# EasyEDA Pro project 心电检测采集模块.eprj

# Schematic Schematic1
Create Date: 2024-03-05; Page Name: P1; Project Name: 心电检测采集模块; Schematic Name: Schematic1; Update Date: 2024-03-05; Company: 嘉立创EDA; Page Size: A4; Version: V1.0
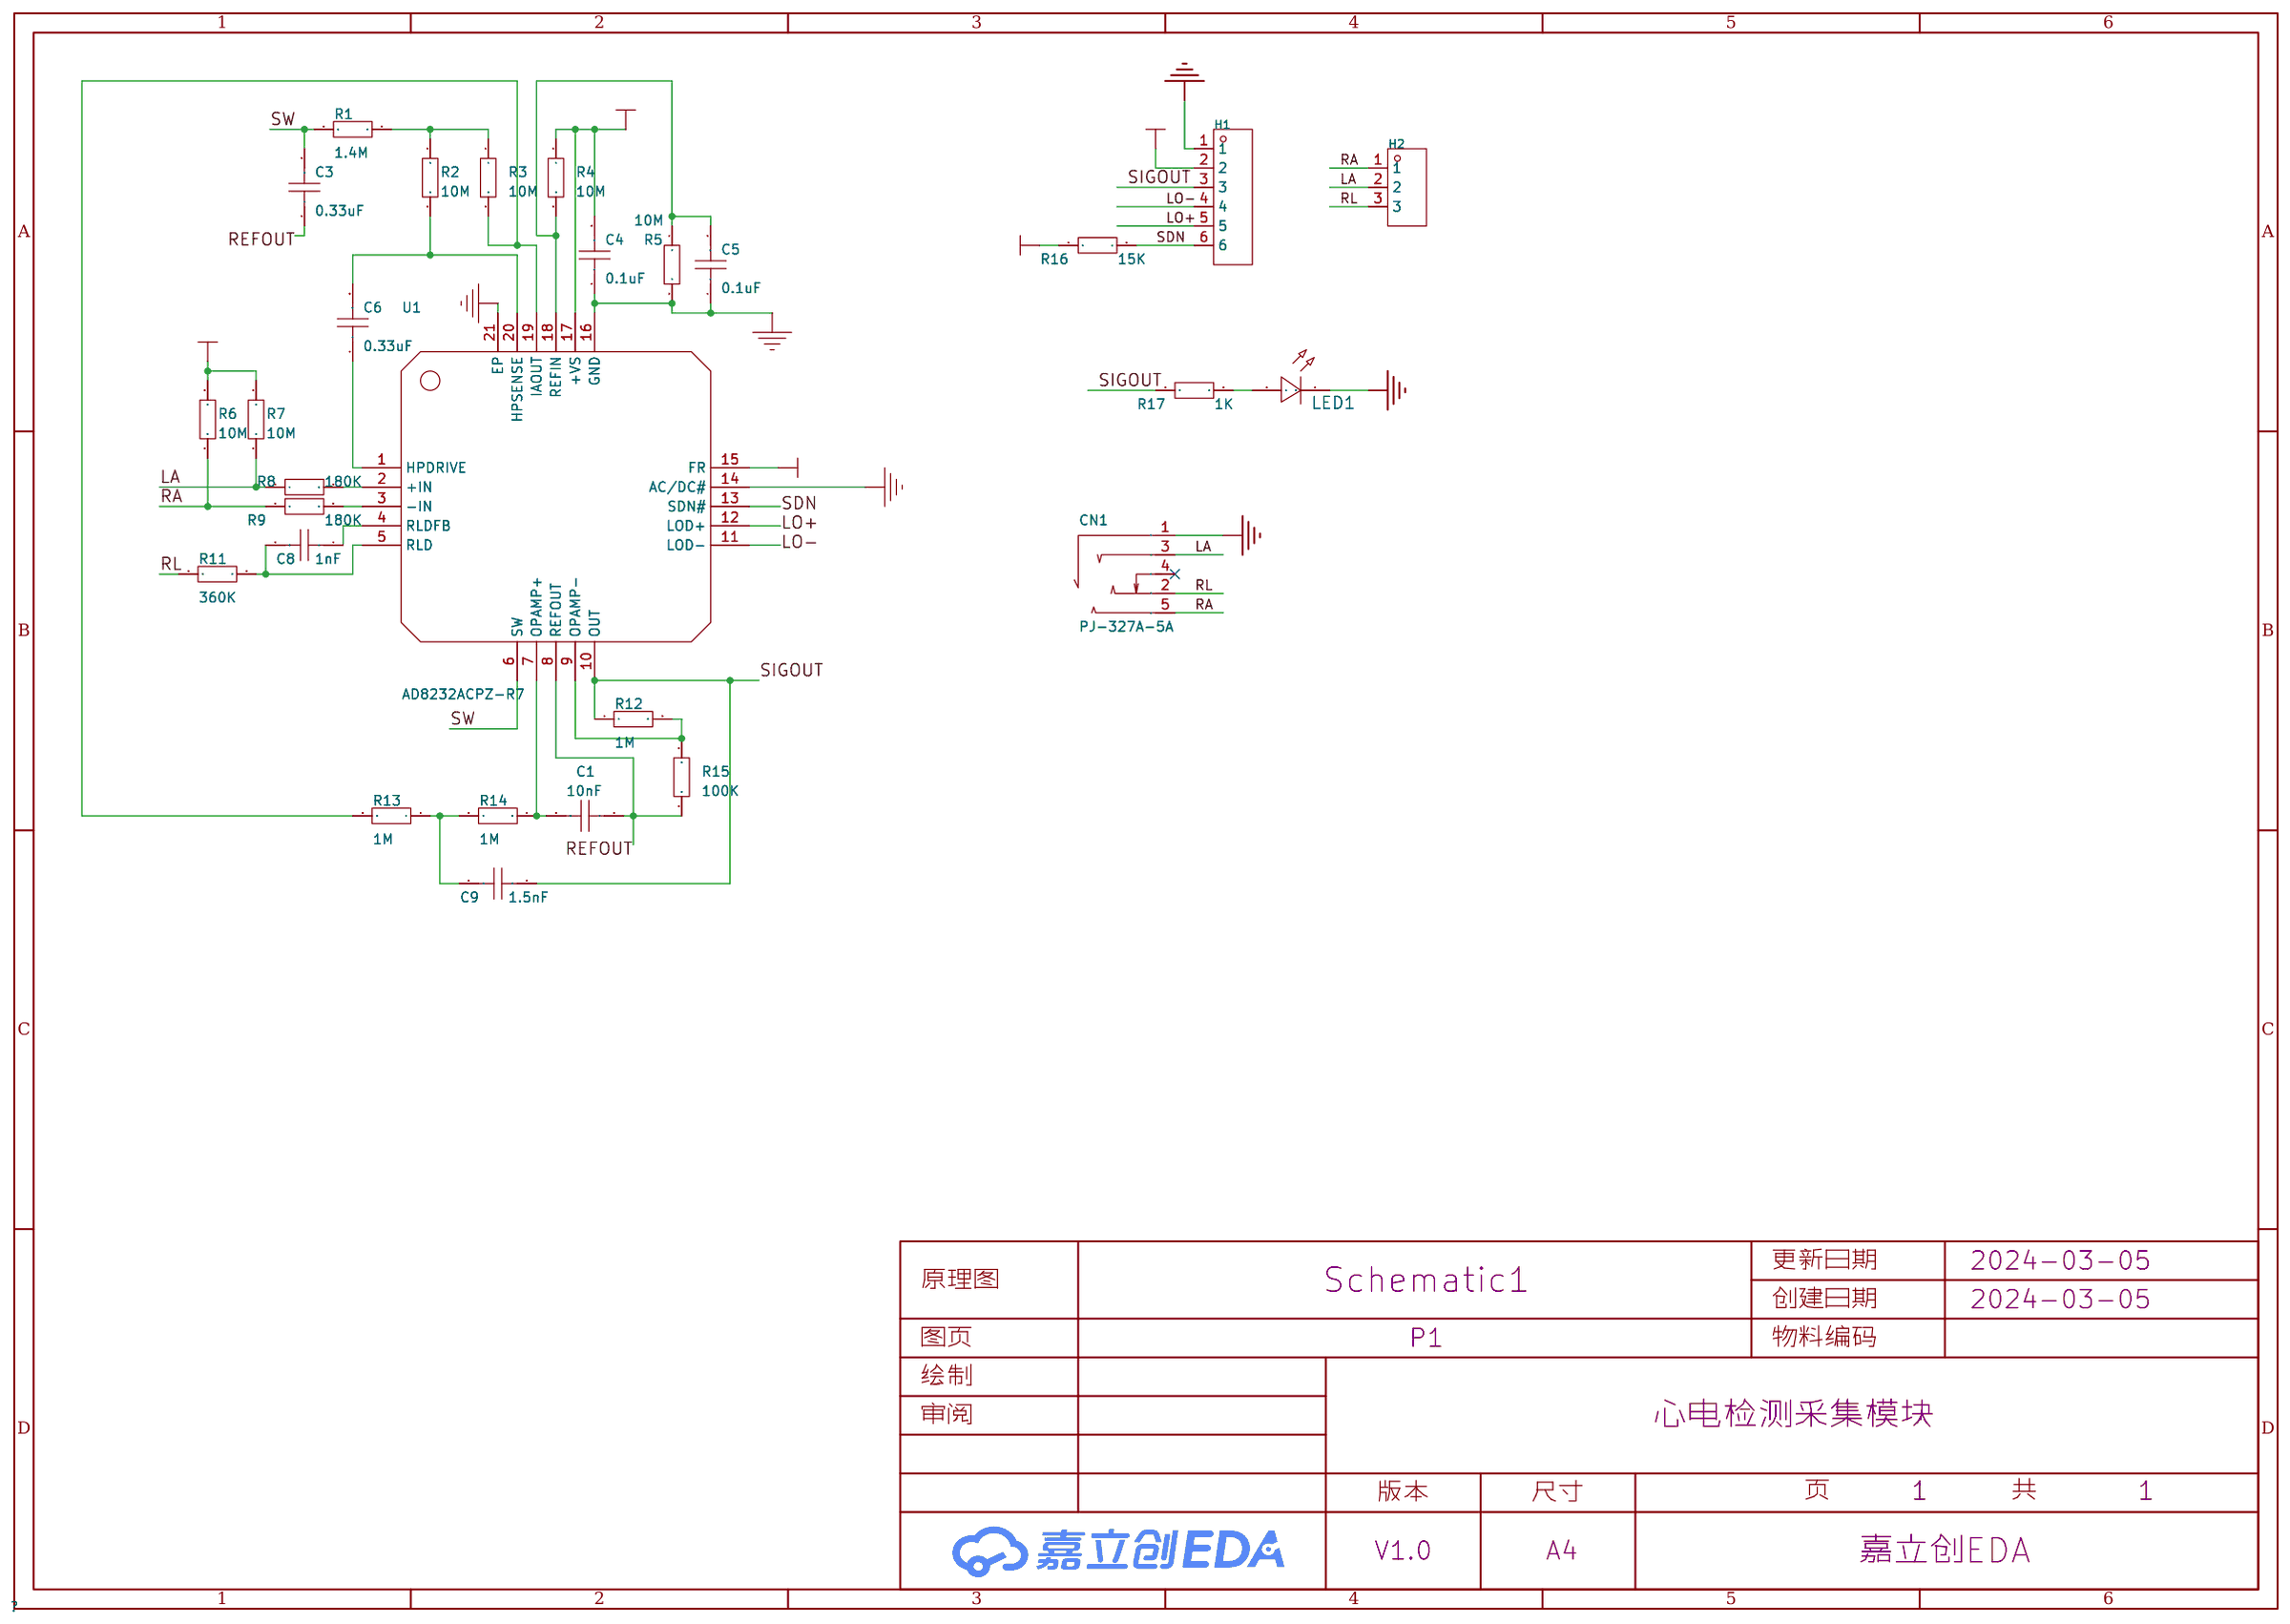
[diagram p0: schematic sheet]

## Parts
C1  10nF  [C0402]
C3  0.33uF  [C0402]
C4  0.1uF  [C0402]
C5  0.1uF  [C0402]
C6  0.33uF  [C0402]
C8  1nF  [C0402]
C9  1.5nF  [C0402]
CN1  PJ-327A-5A  [AUDIO-SMD_PJ-327A-5A]
H1  -  [HDR-TH_6P-P2.54-V-F]
H2  -  [HDR-TH_3P-P2.54-V-F]
LED1  -  [LED_0603]
R1  1.4M  [R0402]
R2  10M  [R0402]
R3  10M  [R0402]
R4  10M  [R0402]
R5  10M  [R0402]
R6  10M  [R0402]
R7  10M  [R0402]
R8  180K  [R0402]
R9  180K  [R0402]
R11  360K  [R0402]
R12  1M  [R0402]
R13  1M  [R0402]
R14  1M  [R0402]
R15  100K  [R0402]
R16  15K  [R0402]
R17  1K  [R0402]
U1  AD8232ACPZ-R7  [LFCSP-20_L4.0-W4.0-P0.50-TL-EP2.7]

## Library data of the parts
C1 C3-C6 C8 C9 = CAP_0402: Supplier Footprint: 0402
CN1 = PJ-327A-5A: 连接器类型:3.5mm耳机座;额定电流:500mA;额定电压:30V;工作温度范围:-40℃~+80℃;; LCSC Part Name: 3.5mm耳机座; Supplier Part: C840364; Manufacturer: 韩国韩荣; Supplier Footprint: SMD; JLCPCB Part Class: Extended Part; Datasheet: https://atta.szlcsc.com/upload/public/pdf/source/20200918/C840364_74290012F76780C6C7E2B668A307BBBC.pdf; Supplier: LCSC; Connector Type: 3.5mm耳机座; Current Rating (Max): 500mA; Voltage Rating (Max): 30V; Operating Temperature Range: -40℃~+80℃
H1 = HDR-F_2.54_1x6P: Supplier Part: C40877; Supplier Footprint: 插件
H2 = HDR-F_2.54_1x3P: Supplier Part: C541850; Supplier Footprint: 插件
LED1 = LED_0603-R: Supplier Footprint: 0603
R1-R9 R11-R17 = Res_0402: Supplier Footprint: 0402
U1 = AD8232ACPZ-R7: Supplier Part: C43216; Manufacturer: ADI(亚德诺); Supplier Footprint: LFCSP-20(4x4); JLCPCB Part Class: Extended Part; Datasheet: https://atta.szlcsc.com/upload/public/pdf/source/20150319/1457707267132.pdf; Supplier: LCSC

## Nets
GND: C4.1 C5.1 CN1.1 H1.1 LED1.1(C) R5.2 U1.14(AC/DC#) U1.16(GND) U1.21(EP)
LA: CN1.3 H2.2 R7.1 R8.1
LO+: H1.5 U1.12(LOD+)
LO-: H1.4 U1.11(LOD-)
RA: CN1.5 H2.1 R6.1 R9.1
REFOUT: C1.1 C3.1 R15.2 U1.8(REFOUT)
RL: CN1.2 H2.3 R11.1
SDN: H1.6 R16.2 U1.13(SDN#)
SIGOUT: C9.1 H1.3 R12.1 R17.1 U1.10(OUT)
SW: C3.2 R1.2 U1.6(SW)
VS: C4.2 H1.2 R4.1 R6.2 R7.2 R16.1 U1.15(FR) U1.17(+VS)
$1N1619: C5.2 R4.2 R5.1 U1.18(REFIN)
$1N1644: R3.2 R13.2 U1.19(IAOUT)
$1N1653: R1.1 R2.1 R3.1
$1N1658: C6.2 R2.2 U1.20(HPSENSE)
$1N1680: C6.1 U1.1(HPDRIVE)
$1N1683: C9.2 R13.1 R14.2
$1N1688: C1.2 R14.1 U1.7(OPAMP+)
$1N1699: R12.2 R15.1 U1.9(OPAMP-)
$1N1716: R8.2 U1.2(+IN)
$1N1718: R9.2 U1.3(-IN)
$1N1730: C8.2 R11.2 U1.5(RLD)
$1N1739: C8.1 U1.4(RLDFB)
$1N2209: LED1.2(A) R17.2

Not connected (* = marked no-connect by the designer): CN1 4*

# Schematic AD8232_0402ascii
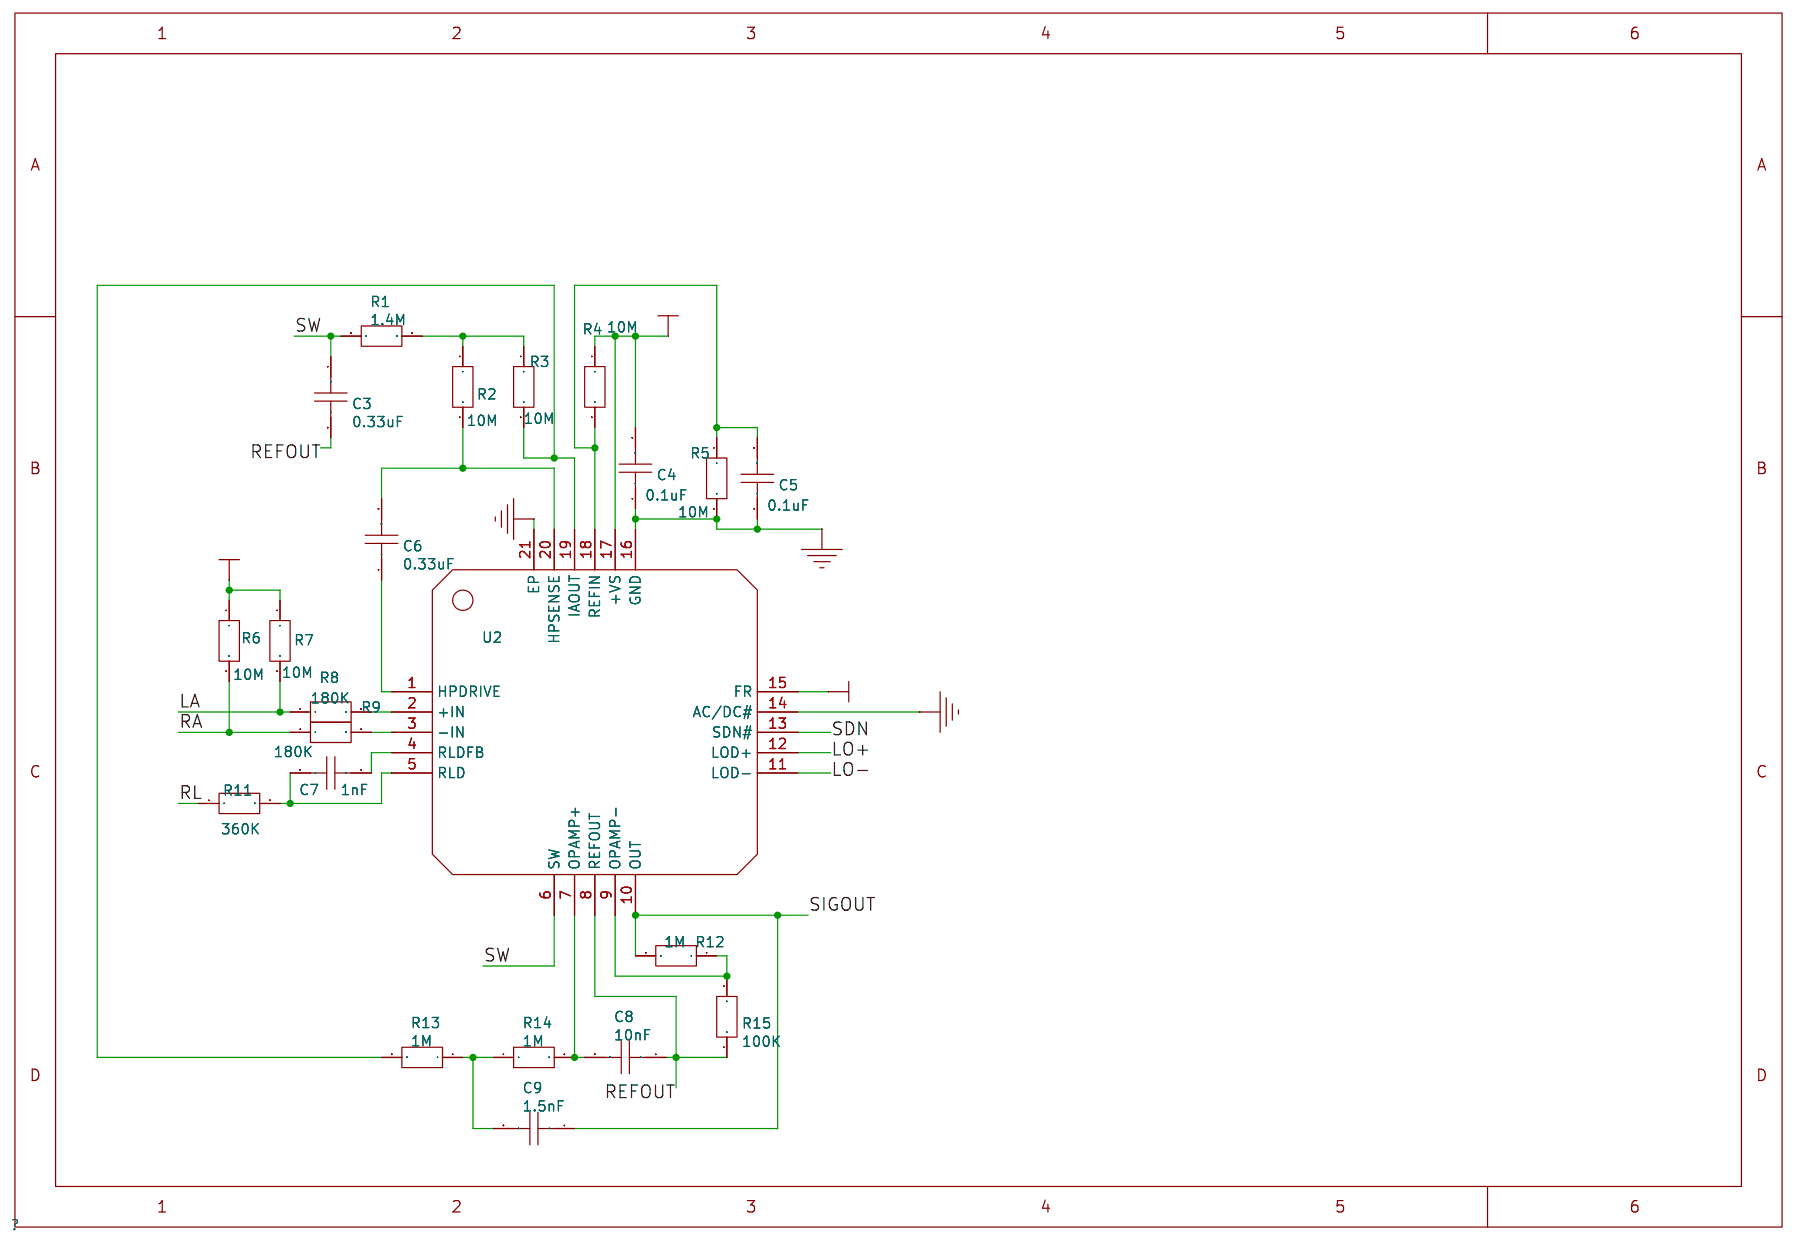
[diagram p1: schematic sheet]

## Parts
C3  0.33uF
C4  0.1uF
C5  0.1uF
C6  0.33uF
C7  1nF
C8  10nF
C9  1.5nF
R1  1.4M
R2  10M
R3  10M
R4  10M
R5  10M
R6  10M
R7  10M
R8  180K
R9  180K
R11  360K
R12  1M
R13  1M
R14  1M
R15  100K
U2  AD8232ACPZ-R7

## Library data of the parts
C3 C6 = 0.33uF: Supplier: LCSC; Supplier Part: C525264; Manufacturer: PSA(Prosperity Dielectrics); Manufacturer Part: FN18X103K500PSG
C4 C5 = 0.1uF: Supplier: LCSC; Supplier Part: C525264; Manufacturer: PSA(Prosperity Dielectrics); Manufacturer Part: FN18X103K500PSG
C7 = 1nF: Supplier: LCSC; Supplier Part: C525264; Manufacturer: PSA(Prosperity Dielectrics); Manufacturer Part: FN18X103K500PSG
C8 = 10nF: Supplier: LCSC; Supplier Part: C525264; Manufacturer: PSA(Prosperity Dielectrics); Manufacturer Part: FN18X103K500PSG
C9 = 1.5nF: Supplier: LCSC; Supplier Part: C525264; Manufacturer: PSA(Prosperity Dielectrics); Manufacturer Part: FN18X103K500PSG
R1 = 1.4M: Supplier: LCSC; Supplier Part: C965177; Manufacturer: UNI-ROYAL(Uniroyal Elec); Manufacturer Part: NQ03WAF1602T5E
R2-R7 = 10M: Supplier: LCSC; Supplier Part: C965177; Manufacturer: UNI-ROYAL(Uniroyal Elec); Manufacturer Part: NQ03WAF1602T5E
R8 R9 = 180K: Supplier: LCSC; Supplier Part: C965177; Manufacturer: UNI-ROYAL(Uniroyal Elec); Manufacturer Part: NQ03WAF1602T5E
R11 = 360K: Supplier: LCSC; Supplier Part: C965177; Manufacturer: UNI-ROYAL(Uniroyal Elec); Manufacturer Part: NQ03WAF1602T5E
R12-R14 = 1M: Supplier: LCSC; Supplier Part: C965177; Manufacturer: UNI-ROYAL(Uniroyal Elec); Manufacturer Part: NQ03WAF1602T5E
R15 = 100K: Supplier: LCSC; Supplier Part: C965177; Manufacturer: UNI-ROYAL(Uniroyal Elec); Manufacturer Part: NQ03WAF1602T5E
U2 = AD8232ACPZ-R7: Supplier: LCSC; Manufacturer: ADI; image: //image.lceda.cn/szlcsc/C43216.jpg; Supplier Part: C43216; Paste Type: expand

## Nets
GND: C4.1 C5.1 R5.2 U2.14(AC/DC#) U2.16(GND) U2.21(EP)
LA: R7.2 R8.1
LO+: U2.12(LOD+)
LO-: U2.11(LOD-)
RA: R6.2 R9.1
REFOUT: C3.2 C8.1 R15.1 U2.8(REFOUT)
RL: R11.1
SDN: U2.13(SDN#)
SIGOUT: C9.1 R12.2 U2.10(OUT)
SW: C3.1 R1.1 U2.6(SW)
VS: C4.2 R4.1 R6.1 R7.1 U2.15(FR) U2.17(+VS)
Net-(C5-2): C5.2 R4.2 R5.1 U2.18(REFIN)
Net-(C6-1): C6.1 U2.1(HPDRIVE)
Net-(C6-2): C6.2 R2.2 U2.20(HPSENSE)
Net-(C7-1): C7.1 U2.4(RLDFB)
Net-(C7-2): C7.2 R11.2 U2.5(RLD)
Net-(C8-2): C8.2 R14.2 U2.7(OPAMP+)
Net-(C9-2): C9.2 R13.1 R14.1
Net-(R1-2): R1.2 R2.1 R3.1
Net-(R3-2): R3.2 R13.2 U2.19(IAOUT)
Net-(R8-2): R8.2 U2.2(+IN)
Net-(R9-2): R9.2 U2.3(-IN)
Net-(R12-1): R12.1 R15.2 U2.9(OPAMP-)

# Board PCB1
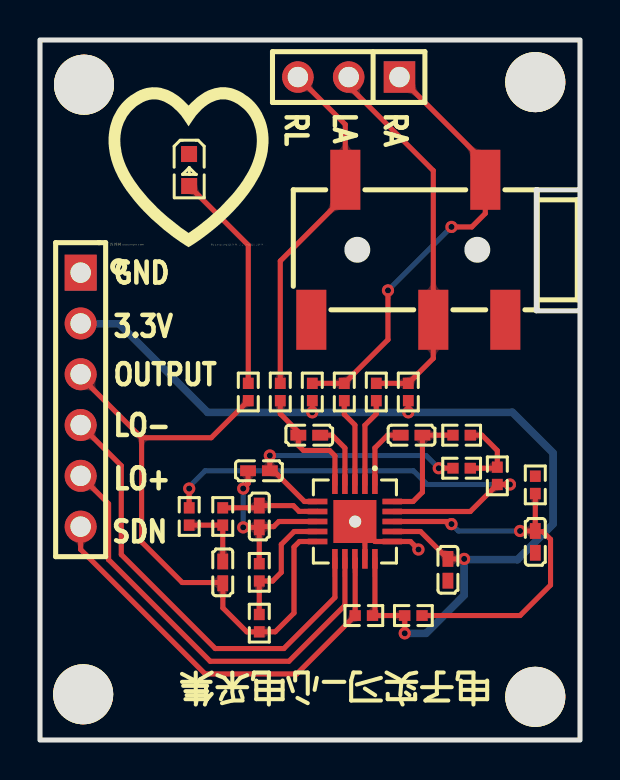
[diagram p2: board, top side]
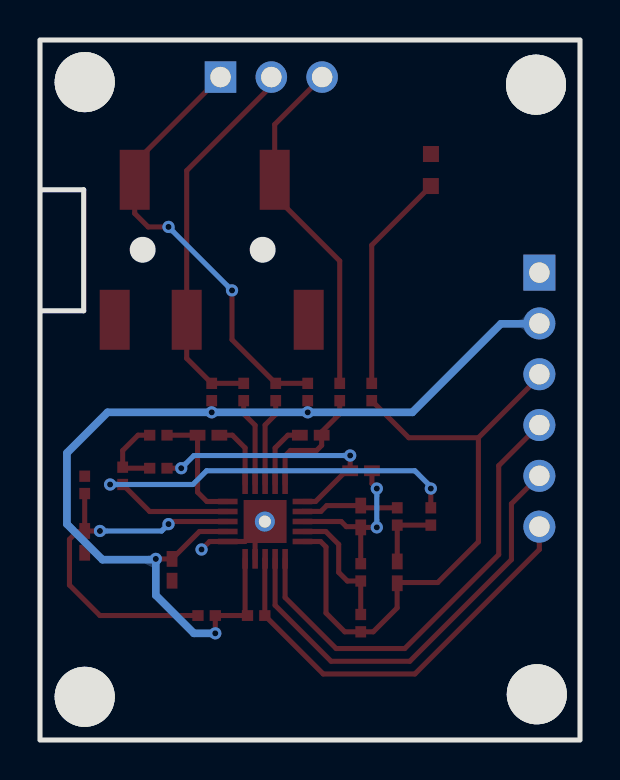
[diagram p3: board, bottom side, seen from below]

Outline 27 x 35 mm; copper layers: Top Layer, Bottom Layer. Coordinates in mm from the lower left corner of the outline.
Outline path: rectangle 0,35 27,0
Stack: Top Layer 0.035mm / Dielectric1 1.51mm FR4 er 4.5 / Bottom Layer 0.035mm

## Design rules (mm)
template: JLCPCB Capability(Two Layers Board)
spacing copperThickness1oz (default): track to track 0.102, other pairs 0.152 to 0.3
spacing copperThickness2oz: track to track 0.203, other pairs 0.152 to 0.3
track width copperThickness1oz (default): min 0.127, default 0.254, max 2.54
track width copperThickness2oz: min 0.203, default 0.254, max 2.54
differential pair differentialPair (default): width min 0.127, default 0.254, max 2.54; gap min 0.152, default 0.152
via viaSize (default): diameter min 0.5, default 0.61, max 10; hole min 0.3, default 0.305, max 6.3

## Placement (name value [footprint] x y rotation side)
C1  10nF  [C0402]  10.96 11.18 90 top
C3  0.33uF  [C0402]  10.95 13.46 0 top
C4  0.1uF  [C0402]  20.4 8.51 90 top
C5  0.1uF  [C0402]  24.76 9.91 90 top
C6  0.33uF  [C0402]  18.58 15.24 0 top
C8  1nF  [C0402]  13.46 15.24 180 top
C9  1.5nF  [C0402]  9.14 8.38 90 top
CN1  PJ-327A-5A  [AUDIO-SMD_PJ-327A-5A]  18.41 24.51 180 top
H1  -  [HDR-TH_6P-P2.54-V-F]  2.03 17.02 270 top
H2  -  [HDR-TH_3P-P2.54-V-F]  15.43 33.15 180 top
LED1  -  [LED_0603]  7.46 28.45 270 top
NOREF  -  [Pad_e689]  24.76 32.89 0 top
NOREF#2  -  [Pad_e691]  2.16 2.29 0 top
NOREF#3  -  [Pad_e443]  15.76 10.92 0 top
NOREF#4  -  [Pad_e690]  24.76 2.16 0 top
NOREF#5  -  [Pad_e687]  2.2 32.77 0 top
R1  1.4M  [R0402]  21.08 13.59 180 top
R2  10M  [R0402]  21.08 15.24 180 top
R3  10M  [R0402]  22.87 13.21 270 top
R4  10M  [R0402]  18.67 6.22 0 top
R5  10M  [R0402]  24.76 12.76 90 top
R6  10M  [R0402]  13.61 17.4 270 top
R7  10M  [R0402]  18.41 17.4 270 top
R8  180K  [R0402]  16.81 17.4 270 top
R9  180K  [R0402]  15.21 17.4 270 top
R11  360K  [R0402]  12.01 17.4 270 top
R12  1M  [R0402]  10.96 5.84 90 top
R13  1M  [R0402]  7.46 11.18 90 top
R14  1M  [R0402]  9.14 11.18 270 top
R15  100K  [R0402]  10.96 8.38 90 top
R16  15K  [R0402]  16.19 6.22 180 top
R17  1K  [R0402]  10.41 17.4 90 top
U1  AD8232ACPZ-R7  [LFCSP-20_L4.0-W4.0-P0.50-TL-EP2.7]  15.75 10.92 270 top

## Footprints (pads in the part's own frame, mm; a bottom-side part is the same pattern mirrored in y, then rotated)
AUDIO-SMD_PJ-327A-5A
  rect 1.5x3 smd: 1(-4.85,3.5) 2(3.15,-3.5) 3(-1.25,3.5) 4(4.85,3.5) 5(-3.85,-3.5)
C0402
  rect 0.79x0.54 smd: 1(-0.545,0) 2(0.545,0)
HDR-TH_3P-P2.54-V-F
  rect 1.575x1.575 hole 1.02: 1(-2.54,0)
  round 1.575 hole 1.02: 2(0,0) 3(2.54,0)
HDR-TH_6P-P2.54-V-F
  rect 1.8x1.6 hole 1.02: 1(-6.35,0)
  round 1.6 hole 1.02: 2(-3.81,0) 3(-1.27,0) 4(1.27,0) 5(3.81,0) 6(6.35,0)
LED_0603
  rect 0.8x0.8 smd: 1(-0.851,-0.01) 2(0.75,-0.005)
LFCSP-20_L4.0-W4.0-P0.50-TL-EP2.7
  rect 0.985x0.28 smd: 1(-1.867,1) 2(-1.867,0.5) 3(-1.867,0) 4(-1.867,-0.5) 5(-1.867,-1) 11(1.867,-1) 12(1.867,-0.5) 13(1.867,0) 14(1.867,0.5) 15(1.867,1)
  rect 0.28x0.985 smd: 6(-1,-1.867) 7(-0.5,-1.867) 8(0,-1.867) 9(0.5,-1.867) 10(1,-1.867) 16(1,1.867) 17(0.5,1.867) 18(0,1.867) 19(-0.5,1.867) 20(-1,1.867)
  rect 2.15x2.15 smd: 21(0,0)
Pad_e443
  round 1 hole 0.6: 22(0,0)
Pad_e687
  round 3 hole 3: 23(0,0)
Pad_e689
  round 3 hole 3: 23(0,0)
Pad_e690
  round 3 hole 3: 23(0,0)
Pad_e691
  round 3 hole 3: 23(0,0)
R0402
  rect 0.566x0.54 smd: 1(-0.433,0) 2(0.433,0)

## Nets
As in the schematic, except:
GND: C4.1 C5.1 CN1.1 H1.1 LED1.1 NOREF.23 NOREF#2.23 NOREF#3.22 NOREF#4.23 NOREF#5.23 R5.2 U1.14 U1.16 U1.21

Pads without a net: CN1 4

## Via types
v1: diameter 0.61, hole 0.305, Top Layer to Bottom Layer, 15 vias

## Routing (per net, layer and track width the routed paths; a pad name or vN(x,y) marks a point on that pad's centre or on a via; arc(x,y) is an arc through that point)
GND: length 5.1
  Top Layer w0.254: 16.25,10.42 U1.21 ; 16.25,10.42 U1.14 ; 16.25,10.42 16.75,9.92 U1.16 18.52,9.92 v1(18.92,9.53)
LA: length 19.2
  Top Layer w0.254: H2.2 15.43,32.7 19.66,28.47 CN1.3 19.66,19.08 R7.1 R8.1
LO+: length 22.2
  Top Layer w0.254: U1.12 15.25,6.74 12.45,3.94 8.51,3.94 3.43,9.02 3.43,11.81 H1.5
LO-: length 22.9
  Top Layer w0.254: H1.4 4.06,13.72 4.06,9.27 8.76,4.57 12.19,4.57 14.75,7.13 U1.11
RA: length 22.2
  Top Layer w0.254: H2.1 22.26,28.86 CN1.5 22.26,26.33 21.59,25.65 v1(20.57,25.65) ; R6.1 R9.1 17.4,20.02 v1(17.4,22.48)
  Bottom Layer w0.254: v1(20.57,25.65) v1(17.4,22.48)
REFOUT: length 8.6
  Top Layer w0.254: R15.2 C1.1 ; C1.1 11,10.67 11.68,10.67 11.94,10.92 U1.8 ; C1.1 v1(10.16,10.63) ; v1(10.16,12.57) 10.4,12.81 C3.1
  Bottom Layer w0.254: v1(10.16,10.63) v1(10.16,12.57)
RL: length 17.6
  Top Layer w0.254: R11.1 12.01,23.95 15.26,27.2 CN1.2 15.26,30.78 H2.3
SDN: length 21.5
  Top Layer w0.254: U1.13 15.76,9.04 R16.2 12.84,3.3 8.25,3.3 2.03,9.53 H1.6
SIGOUT: length 30.9
  Top Layer w0.254: R17.1 8.56,15.11 5.08,15.11 ; U1.10 12.97,9.92 12.7,9.65 12.7,6.35 11.76,5.41 R12.1 10.34,5.41 9.14,6.6 9.14,7.83 C9.1 9.1,7.87 7.11,7.87 5.08,9.91 5.08,15.11 ; H1.3 2.03,18.16 5.08,15.11
SW: length 13.2
  Top Layer w0.254: R1.2 v1(19.94,13.59) ; v1(11.49,14.22) C3.2 11.68,13.46 13.22,11.92 U1.6
  Bottom Layer w0.254: v1(11.49,14.22) 19.3,14.22 v1(19.94,13.59)
VS: length 51.3
  Top Layer w0.254: R7.2 v1(18.41,16.38) ; v1(18.24,5.33) R4.1 16.87,6.22 16.75,6.34 ; v1(21.21,9.05) C4.2 19.03,10.42 U1.17 ; R6.2 v1(13.61,16.38) ; 16.75,6.34 U1.15 ; 16.75,6.34 R16.1
  Bottom Layer w0.381: v1(18.24,5.33) 19.3,5.33 21.21,7.24 v1(21.21,9.05) 21.25,9.02 23.88,9.02 25.65,10.8 25.65,14.35 23.62,16.38 v1(18.41,16.38) v1(13.61,16.38) 8.38,16.38 3.96,20.81 2.05,20.81 H1.2
$1N1619: length 19.5
  Top Layer w0.254: C5.2 R5.1 ; C5.2 24.8,10.41 25.15,10.41 25.53,10.03 25.53,7.75 24,6.22 R4.2 ; C5.2 v1(24,10.45) ; U1.18 20.44,10.92 v1(20.57,10.8)
  Bottom Layer w0.254: v1(24,10.45) 20.92,10.45 v1(20.57,10.8)
$1N1644: length 24.1
  Top Layer w0.254: 7.46,11.61 v1(7.46,12.57) ; v1(23.5,12.78) 22.87,12.78 21.52,11.42 U1.19
  Bottom Layer w0.254: v1(23.5,12.78) 19.36,12.78 18.67,13.46 8.25,13.46 7.46,12.67 v1(7.46,12.57)
$1N1653: length 3.9
  Top Layer w0.254: R1.1 22.81,13.59 R3.1 22.87,14.47 22.1,15.24 R2.1
$1N1658: length 6.1
  Top Layer w0.254: U1.20 18.66,11.92 19.12,12.39 C6.2 R2.2
$1N1680: length 3.4
  Top Layer w0.254: C6.1 17.38,15.24 16.75,14.61 U1.1
$1N1683: length 3.5
  Top Layer w0.254: C9.2 R14.2 R13.1
$1N1688: length 4.9
  Top Layer w0.254: U1.7 13.87,11.43 12.95,11.43 12.66,11.72 C1.2 10.85,11.61 9.14,11.61
$1N1699: length 6.4
  Top Layer w0.254: U1.9 12.71,10.42 12.06,9.78 12.06,8.38 11.63,7.95 R15.1 R12.2
$1N1716: length 4.4
  Top Layer w0.254: U1.2 16.25,15.74 16.81,16.31 R8.2
$1N1718: length 4.4
  Top Layer w0.254: R9.2 15.21,16.28 15.75,15.75 U1.3
$1N1730: length 6.1
  Top Layer w0.254: U1.5 14.75,14.21 14.48,14.48 13.17,14.48 12.92,14.73 C8.2 12.92,15.4 12.01,16.31 R11.2
$1N1739: length 3.3
  Top Layer w0.254: U1.4 15.25,14.6 14.6,15.24 14.01,15.24
$1N2209: length 11.1
  Top Layer w0.254: LED1.2 10.41,24.74 R17.2

## Copper pours and planes (outline as drawn; the poured copper is in the pictures)
GND on Top Layer: -0.89,36.07 28.07,36.07 28.07,-1.27 -0.89,-1.27
GND on Bottom Layer: -1.65,37.34 29.34,37.34 29.34,-2.92 -1.65,-2.92

Small or netless copper shapes (teardrops, artwork), in the pictures only: 115 on Top Layer, 19 on Bottom Layer

## Text on the board
Top Silkscreen Layer: SDN | GND | 3.3V | OUTPUT | LO- | LO+ | RL | LA | RA | 电子实习—心电采集

# Board AD8232_0402ascii
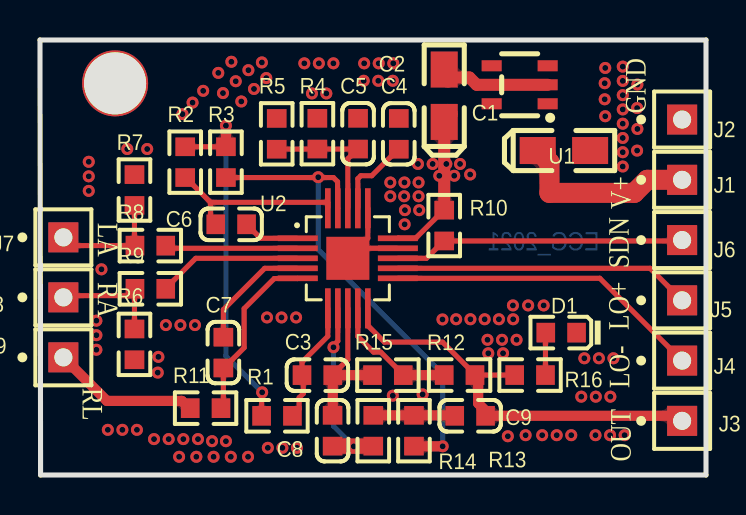
[diagram p4: board, top side]
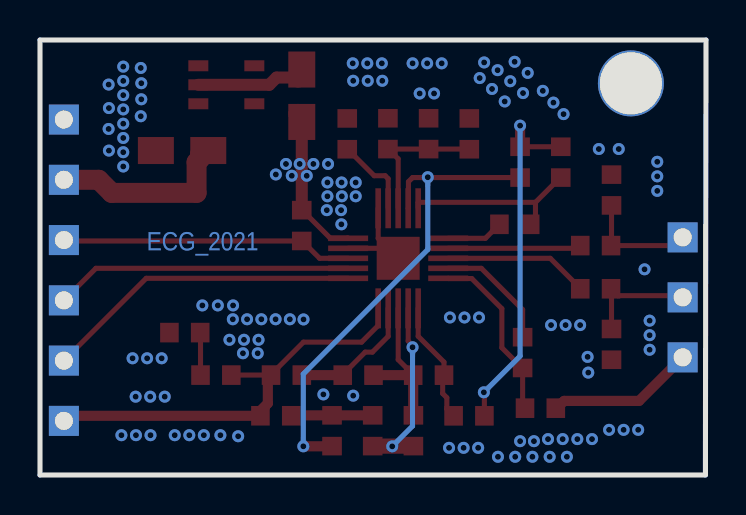
[diagram p5: board, bottom side, seen from below]

Outline 33.3 x 21.75 mm; copper layers: Top Layer, GND, POWER, Bottom Layer. Coordinates in mm from the lower left corner of the outline.
Outline path: 0,21.75 0.03,0 33.3,0 33.3,21.75 0,21.75
Stack: Top Layer 0.0356mm / SUBSTRATE1 0.0711mm PP-006 er 4.1 / GND 0.035mm / SUBSTRATE2 1.2mm Core-009 er 4.5 / POWER 0.035mm / SUBSTRATE3 0.0711mm PP-006 er 4.1 / Bottom Layer 0.0356mm

## Design rules (mm)
spacing Clearance (default): track to track 0.152, other pairs 0.152 to 0.152
track width Width_power (default): min 0.254, default 0.254, max 5
track width Width_other: min 0.254, default 0.254, max 5
differential pair DiffPairsRouting (default): width min 0.381, default 0.381, max 0.381; gap min 0.254, default 0.254
via RoutingVias (default): diameter min 0.4, default 1.27, max 1.27; hole min 0.3, default 0.711, max 0.711

## Placement (name value [footprint] x y rotation side)
C1  1uF  [CASE-A_3216]  26.2 16.22 180 top
C2  1uF  [CASE-A_3216]  20.21 18.96 270 top
C3  0.33uF  [0603_C]  13.87 4.99 0 top
C4  0.1uF  [0603_C]  17.94 17.06 270 top
C5  0.1uF  [0603_C]  15.9 17.07 270 top
C6  0.33uF  [0603_C]  9.56 12.53 180 top
C7  1nF  [0603_C]  9.17 6.12 270 top
C8  10nF  [0603_C]  14.63 2.21 270 top
C9  1.5nF  [0603_C]  21.51 2.96 180 top
D1  红灯 0603  [0603_LED_S1]  26.06 7.12 180 top
J1  HDR-M-2.54_1x1  [PIN1]  32.11 14.76 90 top
J2  HDR-M-2.54_1x1  [PIN1]  32.11 17.77 90 top
J3  HDR-M-2.54_1x1  [PIN1]  32.11 2.71 90 top
J4  HDR-M-2.54_1x1  [PIN1]  32.11 5.72 90 top
J5  HDR-M-2.54_1x1  [PIN1]  32.11 8.73 90 top
J6  HDR-M-2.54_1x1  [PIN1]  32.11 11.75 90 top
J7  HDR-M-2.54_1x1  [PIN1]  1.17 11.88 90 top
J8  HDR-M-2.54_1x1  [PIN1]  1.17 8.88 90 top
J9  HDR-M-2.54_1x1  [PIN1]  1.17 5.88 90 top
NOREF  -  [Pad_ie12]  3.76 19.58 0 top
R1  1.4M  [0603_R]  11.85 2.96 180 top
R2  10M  [0603_R]  7.26 15.64 270 top
R3  10M  [0603_R]  9.3 15.64 270 top
R4  10M  [0603_R]  13.87 17.07 270 top
R5  10M  [0603_R]  11.84 17.06 90 top
R6  10M  [0603_R]  4.72 6.53 90 top
R7  10M  [0603_R]  4.72 14.25 270 top
R8  180K  [0603_R]  5.52 11.47 0 top
R9  180K  [0603_R]  5.52 9.31 0 top
R10  15K  [0603_R]  20.21 12.47 270 top
R11  360K  [0603_R]  8.28 3.34 0 top
R12  1M  [0603_R]  20.98 5 0 top
R13  1M  [0603_R]  18.7 2.21 270 top
R14  1M  [0603_R]  16.66 2.21 270 top
R15  100K  [0603_R]  17.39 4.99 0 top
R16  1K  [0603_R]  24.5 5 0 top
U1  ADP150AUJZ-3.0-R7  [SOT-23-5_L3.0-W1.7-P0.95-LS2.8-BR]  23.98 19.51 0 top
U2  AD8232ACPZ-R7  [LFCSP-20_L4.0-W4.0-P0.50-TL-EP2.7]  15.39 10.83 0 top

## Footprints (pads in the part's own frame, mm; a bottom-side part is the same pattern mirrored in y, then rotated)
0603_C
  rect 0.93x0.98 smd: 1(-0.77,0) 2(0.77,0)
0603_LED_S1
  rect 0.93x0.98 smd: A(0.77,0) K(-0.77,0)
0603_R
  rect 0.93x0.98 smd: 1(-0.77,0) 2(0.77,0)
CASE-A_3216
  rect 1.8x1.35 smd: 1(1.31,0) 2(-1.31,0)
LFCSP-20_L4.0-W4.0-P0.50-TL-EP2.7
  rect 2x0.28 smd: 1(-2.502,1) 2(-2.502,0.5) 3(-2.502,0) 4(-2.502,-0.5) 5(-2.502,-1) 11(2.502,-1) 12(2.502,-0.5) 13(2.502,0) 14(2.502,0.5) 15(2.502,1)
  rect 0.28x2 smd: 6(-1,-2.502) 7(-0.5,-2.502) 8(0,-2.502) 9(0.5,-2.502) 10(1,-2.502) 16(1,2.502) 17(0.5,2.502) 18(0,2.502) 19(-0.5,2.502) 20(-1,2.502)
  rect 2.15x2.15 smd: 21(0,0)
Pad_ie12
  round 3.3 hole 3.1: 2(0,0)
PIN1
  rect 1.5x1.5 hole 0.9: 1(0,0)
SOT-23-5_L3.0-W1.7-P0.95-LS2.8-BR
  rect 1x0.55 smd: 1(1.4,-0.95) 2(1.4,0) 3(1.4,0.95) 4(-1.4,0.95) 5(-1.4,-0.95)

## Nets
GND: C1.2 C2.2 C4.1 C5.1 D1.K J2.1 R5.2 U1.2 U2.14 U2.16 U2.21
V5: C1.1 J1.1 U1.1 U1.3
LA: J7.1 R7.2 R8.1
LO+: J5.1 U2.12
LO-: J4.1 U2.11
NETC5_2: C5.2 R4.2 R5.1 U2.18
NETC6_1: C6.1 U2.1
NETC6_2: C6.2 R2.2 U2.20
NETC7_1: C7.1 U2.4
NETC7_2: C7.2 R11.2 U2.5
NETC8_2: C8.2 R14.2 U2.7
NETC9_2: C9.2 R13.1 R14.1
NETD1_A: D1.A R16.2
NETR1_2: R1.2 R2.1 R3.1
NETR3_2: R3.2 R13.2 U2.19
NETR8_2: R8.2 U2.2
NETR9_2: R9.2 U2.3
NETR12_1: R12.1 R15.2 U2.9
RA: J8.1 R6.2 R9.1
REFOUT: C3.2 C8.1 R15.1 U2.8
RL: J9.1 R11.1
SDN: J6.1 R10.2 U2.13
SIGOUT: C9.1 J3.1 R12.2 R16.1 U2.10
SW: C3.1 R1.1 U2.6
VS: C2.1 C4.2 R4.1 R6.1 R7.1 R10.1 U1.5 U2.15 U2.17

Pads without a net: NOREF 2; U1 4

## Via types
v1: diameter 0.6, hole 0.3, Top Layer to Bottom Layer, 125 vias

## Routing (per net, layer and track width the routed paths; a pad name or vN(x,y) marks a point on that pad's centre or on a via; arc(x,y) is an arc through that point)
GND: length 10.5
  Top Layer w0.254: 15.89,11.33 U2.14 ; 15.89,11.33 16.39,11.83 U2.16 ; 15.89,11.33 U2.21
  Top Layer w0.6: U1.2 21.84,19.51 21.47,19.87 20.39,19.87
  Top Layer w1: 20.39,19.87 20.21,20.05 C2.2
  vias: v1(2.44,15.66) v1(2.44,14.93) v1(2.44,14.21) v1(2.82,7.72) v1(2.82,6.99) v1(2.82,6.26) v1(3.07,10.28) v1(3.39,2.26) v1(4.12,2.26) v1(4.85,2.26) v1(5.7,1.79) v1(6.29,7.5) v1(6.43,1.79) v1(7.02,7.5) v1(6.96,0.91) v1(7.12,18.04) v1(7.17,1.79) v1(7.63,18.62) v1(7.75,7.5) v1(7.82,0.91) v1(7.9,1.79) v1(8.16,19.21) v1(8.6,1.69) v1(8.68,0.91) v1(8.92,20.11) v1(9.15,19.1) v1(9.3,1.69) v1(9.54,0.91) v1(9.57,20.66) v1(9.79,19.69) v1(10.06,18.68) v1(10.42,20.24) v1(10.4,0.91) v1(10.7,19.3) v1(11.09,20.63) v1(11.32,19.85) v1(11.35,7.88) v1(11.39,1.36) v1(12.08,7.88) v1(12.12,1.36) v1(12.8,7.88) v1(12.85,1.36) v1(13.22,20.58) v1(13.94,20.58) v1(14.67,20.58) v1(16.21,20.58) v1(16.19,19.71) v1(16.94,20.58) v1(16.91,19.71) v1(17.52,14.63) v1(17.52,13.94) v1(17.64,19.71) v1(17.64,3.97) v1(17.66,20.58) v1(18.22,14.63) v1(18.21,13.94) v1(18.25,13.24) v1(18.23,12.53) v1(18.93,14.63) v1(18.93,13.94) v1(18.96,13.24) v1(19.13,4.03) v1(20.12,7.78) v1(20.81,7.79) v1(21.52,7.79) v1(22.23,7.79) v1(22.37,6.76) v1(22.42,6.09) v1(22.95,7.79) v1(23.1,6.76) v1(23.15,6.09) v1(23.39,1.94) v1(23.65,8.48) v1(23.66,7.79) v1(23.83,6.76) v1(24.28,1.99) v1(24.41,8.48) v1(25.11,1.99) v1(25.18,8.48) v1(25.84,1.99) v1(26.56,1.99) v1(27.06,3.92) v1(27.22,5.84) v1(27.79,3.92) v1(27.78,1.99) v1(27.95,5.84) v1(28.24,19.59) v1(28.24,18.78) v1(28.26,20.35) v1(28.26,17.94) v1(28.52,3.92) v1(28.5,1.99) v1(28.67,5.84) v1(29.14,20.42) v1(29.14,19.71) v1(29.14,18.99) v1(29.14,18.28) v1(29.14,17.57) v1(29.14,16.85) v1(29.14,16.14) v1(29.14,15.43) v1(29.23,1.99) v1(29.87,19.52) v1(29.86,18.35) v1(29.87,17.3) v1(29.86,16.22)
V5: length 9.4
  Top Layer w1: C1.1 25.11,16.22 25.29,16.05 25.29,15.82 25.47,15.64 25.47,14.11 29.71,14.11 30.36,14.76 J1.1
LA: length 5.5
  Top Layer w0.254: R7.2 4.72,11.49 R8.1 1.79,11.47 1.68,11.58 1.68,11.92
LO+: length 14.7
  Top Layer w0.254: 31.76,8.73 31.76,9.08 30.51,10.33 U2.12
LO-: length 15.8
  Top Layer w0.254: U2.11 27.99,9.83 31.76,6.06 31.76,5.72
NETC5_2: length 7.2
  Top Layer w0.254: 15.88,16.3 C5.2 ; 15.88,16.3 R4.2 11.84,16.3 R5.1 ; 15.88,16.3 15.39,15.81 U2.18
NETC6_1: length 2.9
  Top Layer w0.254: U2.1 11.03,11.83 10.69,12.17 10.67,12.17 10.33,12.51 C6.1 ; 10.08,12.51 10.08,12.53
NETC6_2: length 9.1
  Top Layer w0.254: U2.20 14.39,13.62 14.38,13.63 8.53,13.63 ; 8.53,13.63 8.53,12.8 C6.2 ; 8.53,13.63 7.29,14.87 R2.2
NETC7_1: length 6
  Top Layer w0.254: U2.4 11.23,10.33 9.17,8.27 C7.1
NETC7_2: length 8.8
  Top Layer w0.254: 9.05,3.34 9.17,3.46 C7.2 9.19,5.35 10.21,6.36 10.21,8.32 11.71,9.82 12.88,9.82 U2.5
NETC8_2: length 9.4
  Top Layer w0.254: U2.7 14.89,6.7 14.67,6.48 v1(14.67,6.39)
  Top Layer w0.762: C8.2 R14.2
  Bottom Layer w0.254: v1(15.69,1.43) 14.67,2.45 v1(14.67,6.39)
NETC9_2: length 4.1
  Top Layer w0.254: 20.72,2.98 C9.2
  Top Layer w0.508: R14.1 R13.1 20.72,2.98
NETD1_A: length 2.1
  Top Layer w0.254: R16.2 25.27,7.1 D1.A
NETR1_2: length 18.5
  Top Layer w0.254: 11.08,4.23 R1.2 11.07,2.97 ; R2.1 R3.1
  Top Layer w0.508: R3.1 9.3,17.47
  Bottom Layer w0.254: v1(9.3,17.47) 9.3,5.95 v1(11.11,4.13)
NETR3_2: length 24.5
  Top Layer w0.254: U2.19 14.88,13.35 14.88,14.66 14.67,14.87 R3.2 ; R13.2 18.71,1.43
  Top Layer w0.508: 18.71,1.43 v1(20.14,1.43)
  Bottom Layer w0.254: v1(20.14,1.43) 20.14,5.05 13.91,11.27 v1(13.91,14.89)
NETR8_2: length 6.7
  Top Layer w0.254: R8.2 6.42,11.33 U2.2
NETR9_2: length 7.2
  Top Layer w0.254: R9.2 6.29,9.34 7.79,10.83 U2.3
NETR12_1: length 6.5
  Top Layer w0.254: 20.21,4.99 R12.1 ; U2.9 15.89,6.93 16.68,6.14 17.04,6.14 18.16,5.02 R15.2
  Top Layer w0.508: R15.2 20.21,4.99
RA: length 5.2
  Top Layer w0.254: 4.72,9.28 4.41,8.97 1.79,8.97 1.68,8.86 ; 4.72,9.28 4.72,9.29 R9.1 ; 4.72,9.28 R6.2
REFOUT: length 7.6
  Top Layer w0.254: C8.1 14.64,2.99 ; C3.2 14.64,5.02 15.39,5.77 U2.8
  Top Layer w0.508: 14.64,2.99 C3.2 R15.1
RL: length 7.2
  Top Layer w0.254: 7.43,3.37 7.51,3.37 R11.1 ; 1.69,5.36 1.69,5.91
  Top Layer w0.508: 1.69,5.36 3.35,3.7 7.09,3.7 7.43,3.37
SDN: length 14.2
  Top Layer w0.254: U2.13 19.32,10.83 20.19,11.7 R10.2 31.72,11.7 31.76,11.75
SIGOUT: length 21.1
  Top Layer w0.254: C9.1 22.28,3.22 ; 31.51,2.96 31.76,2.71 ; R12.2 21.75,5.02 20.13,6.64 17.22,6.64 16.39,7.47 U2.10 ; R12.2 R16.1 ; R12.2 21.91,4.84
  Top Layer w0.508: C9.1 31.51,2.96 ; 22.28,3.22 21.91,3.58 21.91,4.84
SW: length 6.2
  Top Layer w0.254: R1.1 12.96,3.3 12.96,3.87 13.17,4.07 13.17,4.93 C3.1 13.1,5.65 14.39,6.94 U2.6
VS: length 11.9
  Top Layer w0.254: U2.15 17.91,11.85 18.79,11.85 20.19,13.24 R10.1 ; U2.17 15.89,14.81 16.04,14.96 16.59,14.96 17.91,16.28 17.93,16.28 C4.2
  Top Layer w0.6: C2.1 R10.1
  Top Layer w1: C2.1 20.21,17.88 20.39,18.05
  vias: v1(4.36,16.3) v1(5.36,16.3) v1(5.92,5.91) v1(5.89,5.12) v1(13.6,19.08) v1(14.32,19.08) v1(18.9,15.55) v1(19.63,15.55) v1(19.96,14.96) v1(20.32,15.55) v1(20.71,14.96) v1(21,15.55) v1(21.51,15.03)

## Copper pours and planes (outline as drawn; the poured copper is in the pictures)
GND on Top Layer: 26.2,2.65 26.23,2.61 31.01,2.61 31.01,8.48 30.46,9.03 16.15,9.03 16.15,2.96 16.47,2.65
GND on Top Layer: 0.79,15.01 0.79,1.68 2.3,0.17 31.09,0.17 32.66,1.75 32.66,19.78 31.17,21.27 9.05,21.27 5.43,17.65 2.89,17.65
GND on Bottom Layer: 0.79,15.09 0.79,1.66 2.26,0.19 31.04,0.19 32.66,1.81 32.66,19.75 31.13,21.29 9.01,21.29 5.39,17.67 2.84,17.67
GND on GND: 0.51,21.24 32.79,21.24 32.79,0.51 0.51,0.51
V5 on Top Layer: 24.28,21.35 24.28,19.98 26.12,19.98 26.19,19.91 26.19,19.09 26.06,18.96 24.66,18.96 24.66,18.29 23.75,17.39 23.75,15.02 26.06,15.02 26.23,15.18 26.31,18.06 26.8,18.83 26.8,21.35
VS on Top Layer: 3.71,14.25 5.74,14.25 5.74,16.6 5.87,16.72 3.71,16.72
VS on Top Layer: 3.71,6.42 6.32,6.42 6.37,6.36 6.37,4.61 3.83,4.61 3.71,4.74
VS on Top Layer: 13.07,17.06 14.77,17.06 14.77,19.45 15.03,19.71 12.96,19.71
VS on Top Layer: 17.15,16.93 17.17,16.91 17.17,15.22 19.15,15.22 19.71,14.66 21.98,14.66 21.98,16.66 23.27,17.95 23.27,18.98 19.39,18.98 18.95,18.54 18.95,16.93
VS on Bottom Layer: 3.71,16.98 3.71,14.25 5.91,14.25 6.12,14.29 6.12,16.96
VS on Bottom Layer: 4.22,6.97 4.22,4.24 6.55,4.24 6.63,4.28 6.63,6.95
VS on Bottom Layer: 12.78,19.85 12.78,17.14 13,16.93 17.15,16.93 17.15,15.24 17.17,15.22 19.15,15.22 19.71,14.66 21.98,14.66 21.98,16.66 23.27,17.95 23.27,18.95 15.67,18.95 14.89,19.72 14.89,19.86
VS on POWER: 0.51,21.24 32.79,21.24 32.79,0.51 0.51,0.51

Small or netless copper shapes (teardrops, artwork), in the pictures only: 94 on Top Layer, 6 on Bottom Layer

## Text on the board
Bottom Layer: ECG_2021
Top Silkscreen Layer: SDN | LO+ | LO- | V+ | OUT | GND | RL | LA | RA
